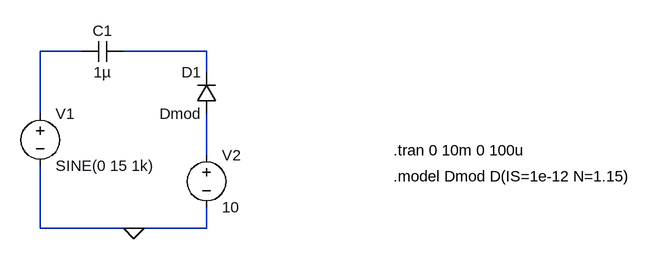
[diagram p0: schematic circuit_a_lt.asc]
circuit_a_lt.asc, the LTspice schematic file:
Version 4
SHEET 1 880 680
WIRE 16 176 -48 176
WIRE 208 176 80 176
WIRE 208 208 208 176
WIRE -48 272 -48 176
WIRE 208 336 208 272
WIRE -48 448 -48 352
WIRE 96 448 -48 448
WIRE 208 448 208 416
WIRE 208 448 96 448
FLAG 96 448 0
SYMBOL voltage -48 256 R0
SYMATTR InstName V1
SYMATTR Value SINE(0 15 1k)
SYMATTR SpiceLine Rser=100k
SYMBOL voltage 208 320 R0
SYMATTR InstName V2
SYMATTR Value 10
SYMBOL diode 224 272 R180
WINDOW 0 24 64 Left 2
WINDOW 3 24 0 Left 2
SYMATTR InstName D1
SYMATTR Value Dmod
SYMBOL cap 80 160 R90
WINDOW 0 0 32 VBottom 2
WINDOW 3 32 32 VTop 2
SYMATTR InstName C1
SYMATTR Value 1µ
TEXT 496 328 Left 2 !.tran 0 10m 0 100u
TEXT 496 368 Left 2 !.model Dmod D(IS=1e-12 N=1.15)

The netlist it stands for:
* circuit_a_lt.asc
V1 N001 0 SINE(0 15 1k) Rser=100k
V2 N003 0 10
D1 N003 N002 Dmod
C1 N002 N001 1µ
.model D D
.lib standard.dio
.tran 0 10m 0 100u
.model Dmod D(IS=1e-12 N=1.15)
.backanno
.end